# EAGLE schematic Schematic (EAGLE 9.6.2)
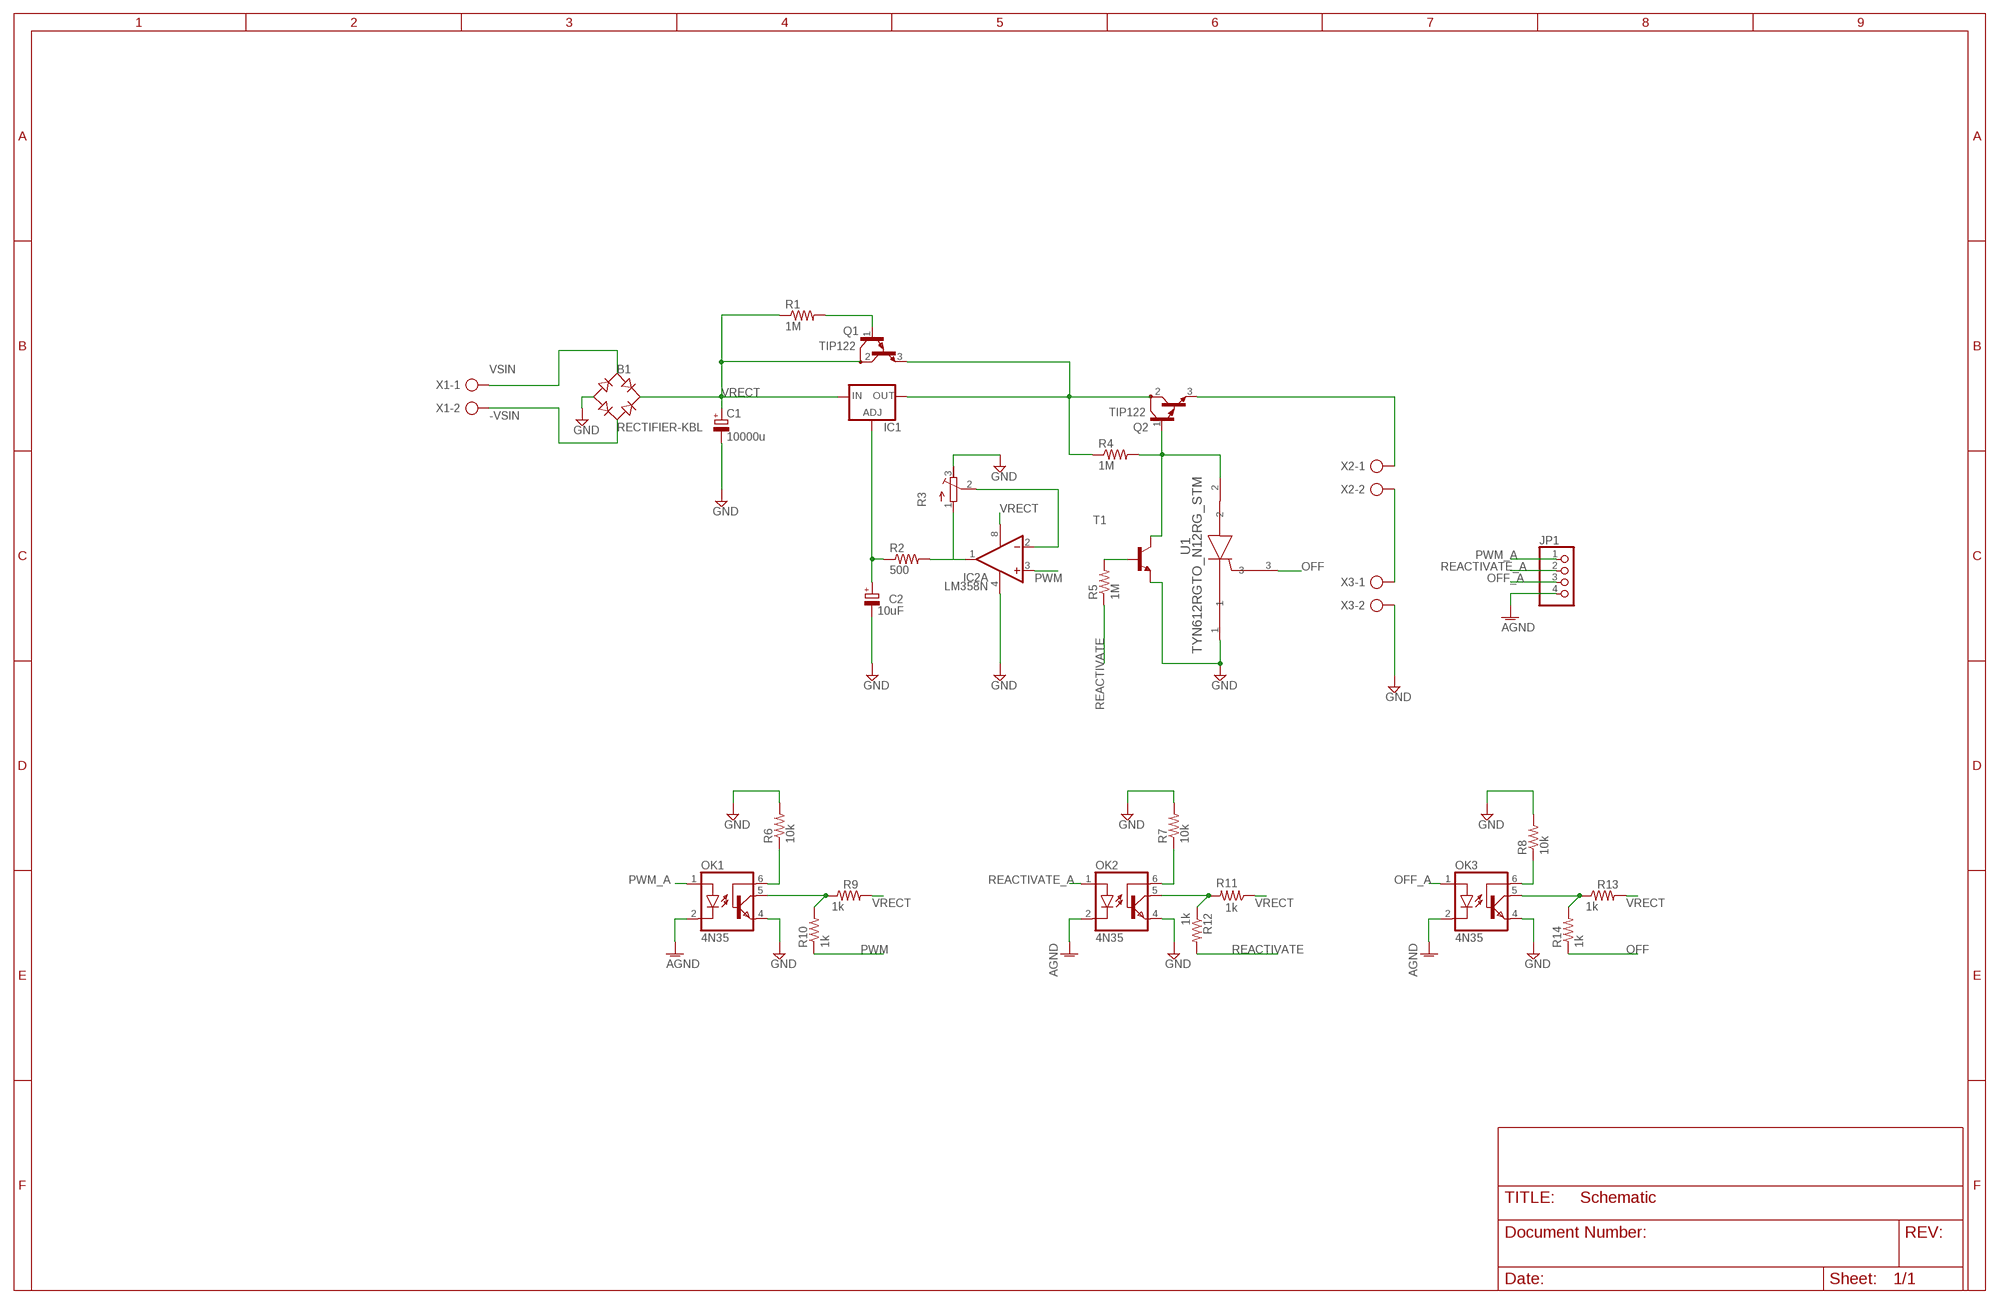
[diagram p0: schematic, sheet 1]

## Parts
B1  RECTIFIER-KBL  [KBL]
C1  10000u  CPOL-EUE10-35  [EB35D]
C2  10uF  CPOL-EUE2-5  [E2-5]
IC1  LM317TS  [317TS]
IC2  LM358N  [DIL08]
JP1  PINHD-1X4  [1X04]
OK1  4N35  [DIL06]
OK2  4N35  [DIL06]
OK3  4N35  [DIL06]
Q1  TIP122  [TO220]
Q2  TIP122  [TO220]
R1  1M  R-US_0207/10  [0207/10]
R2  500  R-US_0207/10  [0207/10]
R3  R-TRIMM64W  [RTRIM64W]
R4  1M  R-US_0207/10  [0207/10]
R5  1M  R-US_0207/10  [0207/10]
R6  10k  R-US_0207/10  [0207/10]
R7  10k  R-US_0207/10  [0207/10]
R8  10k  R-US_0207/10  [0207/10]
R9  1k  R-US_0204/7  [0204/7]
R10  1k  R-US_0204/7  [0204/7]
R11  1k  R-US_0204/7  [0204/7]
R12  1k  R-US_0204/7  [0204/7]
R13  1k  R-US_0204/7  [0204/7]
R14  1k  R-US_0204/7  [0204/7]
T1  2N2222-NPN-TO92-EBC  [TO92-EBC]
U1  TYN612RGTO_N12RG_STM  [TO_N12RG_STM]
X1  AK500/2  [AK500/2]
X2  AK500/2  [AK500/2]
X3  AK500/2  [AK500/2]

## Nets
-VSIN: B1.AC2 X1.2
AGND: OK1.2(C) OK2.2(C) OK3.2(C)
GND: B1.- C1.- C2.- IC2.4(P:V-) JP1.4 OK1.4(EMI) OK2.4(EMI) OK3.4(EMI) R3.3(E) R6.2 R7.2 R8.2 T1.E U1.1 X3.2 ; supply symbol labelled AGND
N$1: IC2.2(A:-IN) R3.2(S)
N$2: R5.2 T1.B
N$3: IC2.1(A:OUT) R2.2 R3.1(A)
N$4: Q1.1(B) R1.2
N$5: C2.+ IC1.1(ADJ) R2.1
N$6: IC1.2(OUT) Q1.3(E) Q2.2(C) R4.1
N$7: OK1.6(BAS) R6.1
N$8: Q2.1(B) R4.2 T1.C U1.2
N$9: Q2.3(E) X2.1
N$10: X2.2 X3.1
N$11: OK3.5(COL) R13.1 R14.2
N$12: OK2.6(BAS) R7.1
N$13: OK2.5(COL) R11.2 R12.1
N$14: OK3.6(BAS) R8.1
N$15: OK1.5(COL) R9.1 R10.2
OFF: R14.1 U1.3
OFF_A: JP1.3 OK3.1(A)
PWM: IC2.3(A:+IN) R10.1
PWM_A: JP1.1 OK1.1(A)
REACTIVATE: R5.1 R12.2
REACTIVATE_A: JP1.2 OK2.1(A)
VRECT: B1.+ C1.+ IC1.3(IN) IC2.8(P:V+) Q1.2(C) R1.1 R9.2 R11.1 R13.2
VSIN: B1.AC1 X1.1
Unconnected: IC2.5(B:+IN) IC2.6(B:-IN) IC2.7(B:OUT)

## Library data of the parts
B1 = rectifier:RECTIFIER-: Rectifier
C1 C2 = rcl:CPOL-EU: POLARIZED CAPACITOR, European symbol; SPICEPREFIX: C
IC1 = v-reg:LM317TS: VOLTAGE REGULATOR
IC2 = linear:LM358: OP AMP also LM158; LM258; LM2904 Source: http://cache.national.com/ds/LM/LM158.pdf
JP1 = pinhead:PINHD-1X4: PIN HEADER
OK1-OK3 = optocoupler:4N35: MOTOROLA OPTO COUPLER; MF: FAIRCHILD SEMICONDUCTOR; MPN: 4N35; OC_FARNELL: 1328375; OC_NEWARK: 72K9946
Q1 Q2 = transistor-npn:TIP122*: NPN Darlington Transistor
R1 R2 R4-R14 = rcl:R-US_: RESISTOR, American symbol; SPICEPREFIX: R
R3 = rcl:R-TRIMM: Trimm resistor; SPICEMODEL: X; SPICEPREFIXL: POT
T1 = transistor-neu-to92:*-NPN-: NPN Transistror
U1 = 2024-05-29_03-51-27_Library:TYN612RG; COPYRIGHT: Copyright (C) 2024 Ultra Librarian. All rights reserved.; MANUFACTURER_PART_NUMBER: TYN612RG; MFR_NAME: STMicroelectronics
X1-X3 = con-ptr500:AK500/2: CONNECTOR; OC_FARNELL: unknown; OC_NEWARK: unknown